# EAGLE design EXPAND (EAGLE 9.3.0)
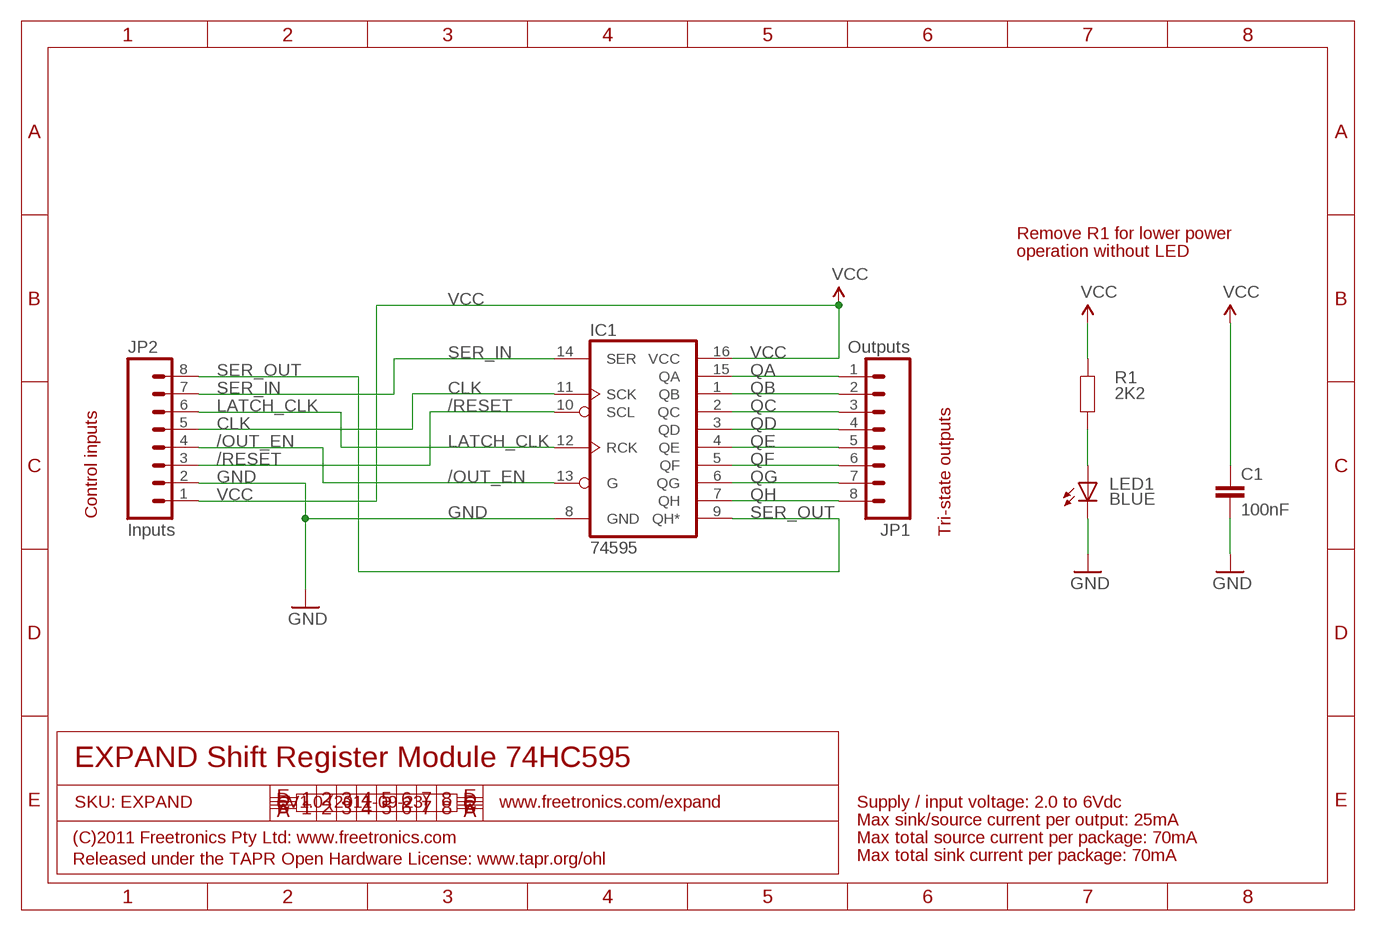
[diagram p0: schematic, sheet 1]

## Parts
C1  100nF  CAP0603  [0603]
IC1  74595  [TSSOP16]
JP1  Outputs  M08  [1X08]
JP2  Inputs  M08  [1X08]
LED1  BLUE  LED0603  [LED-0603]
R1  2K2  RESISTOR0603  [0603]

## Nets
/OUT_EN: IC1.13(G) JP2.4
/RESET: IC1.10(SCL) JP2.3
CLK: IC1.11(SCK) JP2.5
GND: C1.2 IC1.8(GND) JP2.2 LED1.C
LATCH_CLK: IC1.12(RCK) JP2.6
N$1: LED1.A R1.1
QA: IC1.15(QA) JP1.1
QB: IC1.1(QB) JP1.2
QC: IC1.2(QC) JP1.3
QD: IC1.3(QD) JP1.4
QE: IC1.4(QE) JP1.5
QF: IC1.5(QF) JP1.6
QG: IC1.6(QG) JP1.7
QH: IC1.7(QH) JP1.8
SER_IN: IC1.14(SER) JP2.7
SER_OUT: IC1.9(QH*) JP2.8
VCC: C1.1 IC1.16(VCC) JP2.1 R1.2

## Notes on the sheet
- Remove R1 for lower power
- operation without LED
- Control inputs
- Tri-state outputs
- EXPAND Shift Register Module 74HC595
- SKU: EXPAND | V1.0 (2011-09-23) | www.freetronics.com/expand | Supply / input voltage: 2.0 to 6Vdc
- Max sink/source current per output: 25mA
- (C)2011 Freetronics Pty Ltd: www.freetronics.com | Max total source current per package: 70mA
- Released under the TAPR Open Hardware License: www.tapr.org/ohl | Max total sink current per package: 70mA

## Library data of the parts
C1 = freetronics-master-v1.1:CAP: Capacitor Standard 0603 ceramic capacitor, and 0.1" leaded capacitor.
IC1 = freetronics-original:74*595: 8-bit SHIFT REGISTER, output latch
JP1 JP2 = freetronics-master-v1:M08: Header 8 Standard 8-pin 0.1" header. Use with straight break away headers (SKU : PRT-00116), right angle break away headers (PRT-00553), swiss pins (PRT-00743), machine pins (PRT-00117), and female headers (PRT-00115).
LED1 = freetronics-marc:LED: LEDs Standard schematic elements and footprints for 5mm, 3mm, 1206, and 0603 sized LEDs. 5mm - Spark Fun Electronics SKU : COM-00529 (and others)
R1 = freetronics-master-v1:RESISTOR: Resistor Basic schematic elements and footprints for 0603, 1206, and PTH 1/10th watt (small) resistors.

## Board
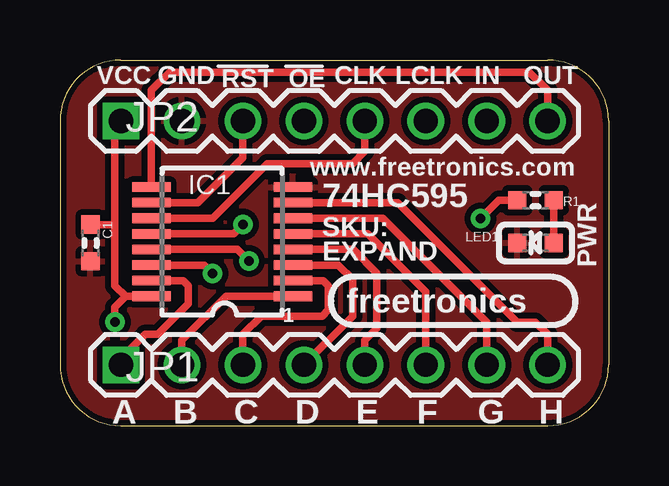
[diagram p1: board, top side]
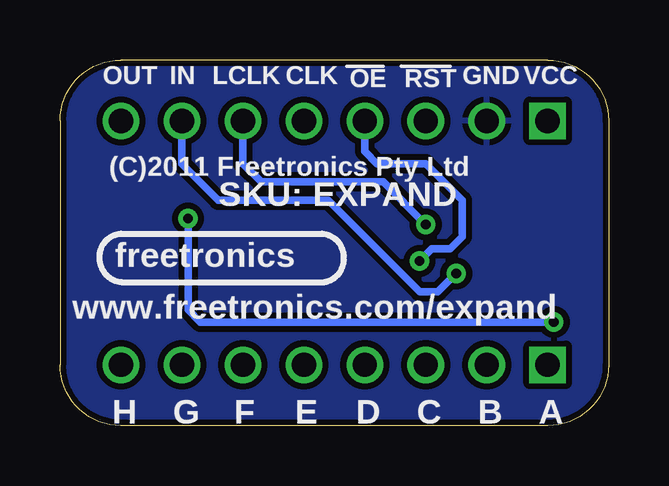
[diagram p2: board, bottom side, seen from below]

Size 22.86 x 15.24 mm. Coordinates in mm from the lower left corner, seen from the top.
Outline: 0,2.54 arc90 2.54,0 20.32,0 arc90 22.86,2.54 22.86,12.7 arc90 20.32,15.24 2.54,15.24 arc90 0,12.7 0,2.54
Copper layers (1*16): Top 0.035mm / dielectric 1.5mm / Bottom 0.035mm
Design rules "default *": minimum track width 8mil, minimum drill 15mil, track to track 10mil, track to pad 10mil, pad to pad 10mil, via to via 10mil, smd to smd 8mil, copper to edge 10mil, drill to drill 8mil, minimum pad ring 10mil, minimum via ring 8mil, stop-mask expansion 4mil, vias tented up to drill 25mil, thermal gap 10mil

### Footprints (pad centres in the part's own frame; a part is rotated, then mirrored left to right if it is on the bottom)
0603 = smd 0.762 x 0.762: 1 -0.762,0; 2 0.762,0
TSSOP16 = smd 0.4 x 1.6: 1 -2.225,-2.85; 2 -1.575,-2.85; 3 -0.925,-2.85; 4 -0.275,-2.85; 5 0.375,-2.85; 6 1.025,-2.85; 7 1.675,-2.85; 8 2.325,-2.85; 9 2.325,3.05; 10 1.675,3.05; 11 1.025,3.05; 12 0.375,3.05; 13 -0.275,3.05; 14 -0.925,3.05; 15 -1.575,3.05; 16 -2.225,3.05
1X08 = drill 1.016 square: 1 0,0 | drill 1.016: 2 2.54,0; 3 5.08,0; 4 7.62,0; 5 10.16,0; 6 12.7,0; 7 15.24,0; 8 17.78,0
LED-0603 = smd 0.762 x 0.762: A -0.762,0; C 0.762,0

### Placement (x,y rotation side)
C1  1.27,7.62 270 top
IC1  6.86,7.62 90 top
JP1  2.54,2.54 0 top
JP2  2.54,12.7 0 top
LED1  19.81,7.62 180 top
R1  19.81,9.4 180 top

### Tracks (layer width: path | path; a pad name or v marks a point on that pad's centre or on a via)
/OUT_EN  (via drill 0.4)
  Top 0.305: IC1.13 7.39,7.34 v7.87,6.86
  Bottom 0.305: v7.87,6.86 7.37,7.37 6.6,7.37 6.1,7.87 6.1,9.4 7.62,10.92 9.65,10.92 10.16,11.43 JP2.4
/RESET
  Top 0.305: IC1.10 5.74,9.29 7.62,11.18 JP2.3
CLK
  Top 0.305: IC1.11 6.36,8.64 8.64,10.92 12.19,10.92 12.7,11.43 JP2.5
GND
  pour Bottom: 2.54,15.24 arc90 0,12.7 0,2.54 arc90 2.54,0 20.32,0 arc90 22.86,2.54 22.86,12.7 arc90 20.32,15.24
  pour Top: 0,12.7 0,2.54 arc90 2.54,0 20.32,0 arc90 22.86,2.54 22.86,12.7 arc90 20.32,15.24 2.54,15.24 arc90
LATCH_CLK  (via drill 0.4)
  Top 0.305: IC1.12 7.23,8 v7.62,8.38
  Bottom 0.305: v7.62,8.38 9.4,10.16 14.48,10.16 15.24,10.92 JP2.6
N$1
  Top 0.305: LED1.A R1.1
QA
  Top 0.305: JP1.1 2.54,2.79 3.56,3.81 4.06,3.81 5.33,5.08 5.33,5.84 5.13,6.04 IC1.15
QB
  Top 0.305: IC1.1 6.92,5.39 5.08,3.56 JP1.2
QC
  Top 0.305: IC1.2 10.97,6.04 11.18,5.84 11.18,4.83 10.92,4.57 8.38,4.57 7.62,3.81 JP1.3
QD
  Top 0.305: IC1.3 11.59,6.7 12.19,6.1 12.19,4.57 JP1.4
QE
  Top 0.305: IC1.4 12.21,7.34 13.21,6.35 13.21,4.06 12.7,3.56 JP1.5
QF
  Top 0.305: IC1.5 12.83,8 15.24,5.59 JP1.6
QG
  Top 0.305: IC1.6 13.45,8.64 17.78,4.32 JP1.7
QH
  Top 0.305: IC1.7 14.07,9.29 19.05,4.32 19.81,4.32 20.32,3.81 JP1.8
SER_IN  (via drill 0.4)
  Top 0.305: IC1.14 6,6.7 v6.35,6.35
  Bottom 0.305: v6.35,6.35 7.11,5.59 7.87,5.59 11.68,9.4 16.26,9.4 17.78,10.92 JP2.7
SER_OUT
  Top 0.305: IC1.9 3.81,10.41 3.81,10.92 3.81,13.97 4.57,14.73 19.56,14.73 20.32,13.97 JP2.8
VCC  (via drill 0.4)
  Top 0.305: v17.53,8.64 18.29,9.4 R1.2 | 2.73,5.39 IC1.16 3.3,5.39 | 2.73,5.39 2.29,5.84 2.29,8.38 | 2.29,8.38 2.29,12.19 2.54,12.45 JP2.1 | v2.29,4.32 2.29,4.95 2.73,5.39 | 2.29,8.38 C1.1
  Bottom 0.305: v17.53,8.64 17.53,4.83 17.02,4.32 v2.29,4.32

### Text on the board
tPlace: VCC | GND | RST | OE | CLK | LCLK | IN | OUT | www.freetronics.com | 74HC595 | SKU: | EXPAND | PWR | freetronics | 1 | A | B | C | D | E | F | G | H
bPlace: VCC | GND | RST | OE | CLK | LCLK | IN | OUT | (C)2011 Freetronics Pty Ltd | SKU: EXPAND | freetronics | www.freetronics.com/expand | A | B | C | D | E | F | G | H